# EAGLE design beacon (EAGLE 6.4)
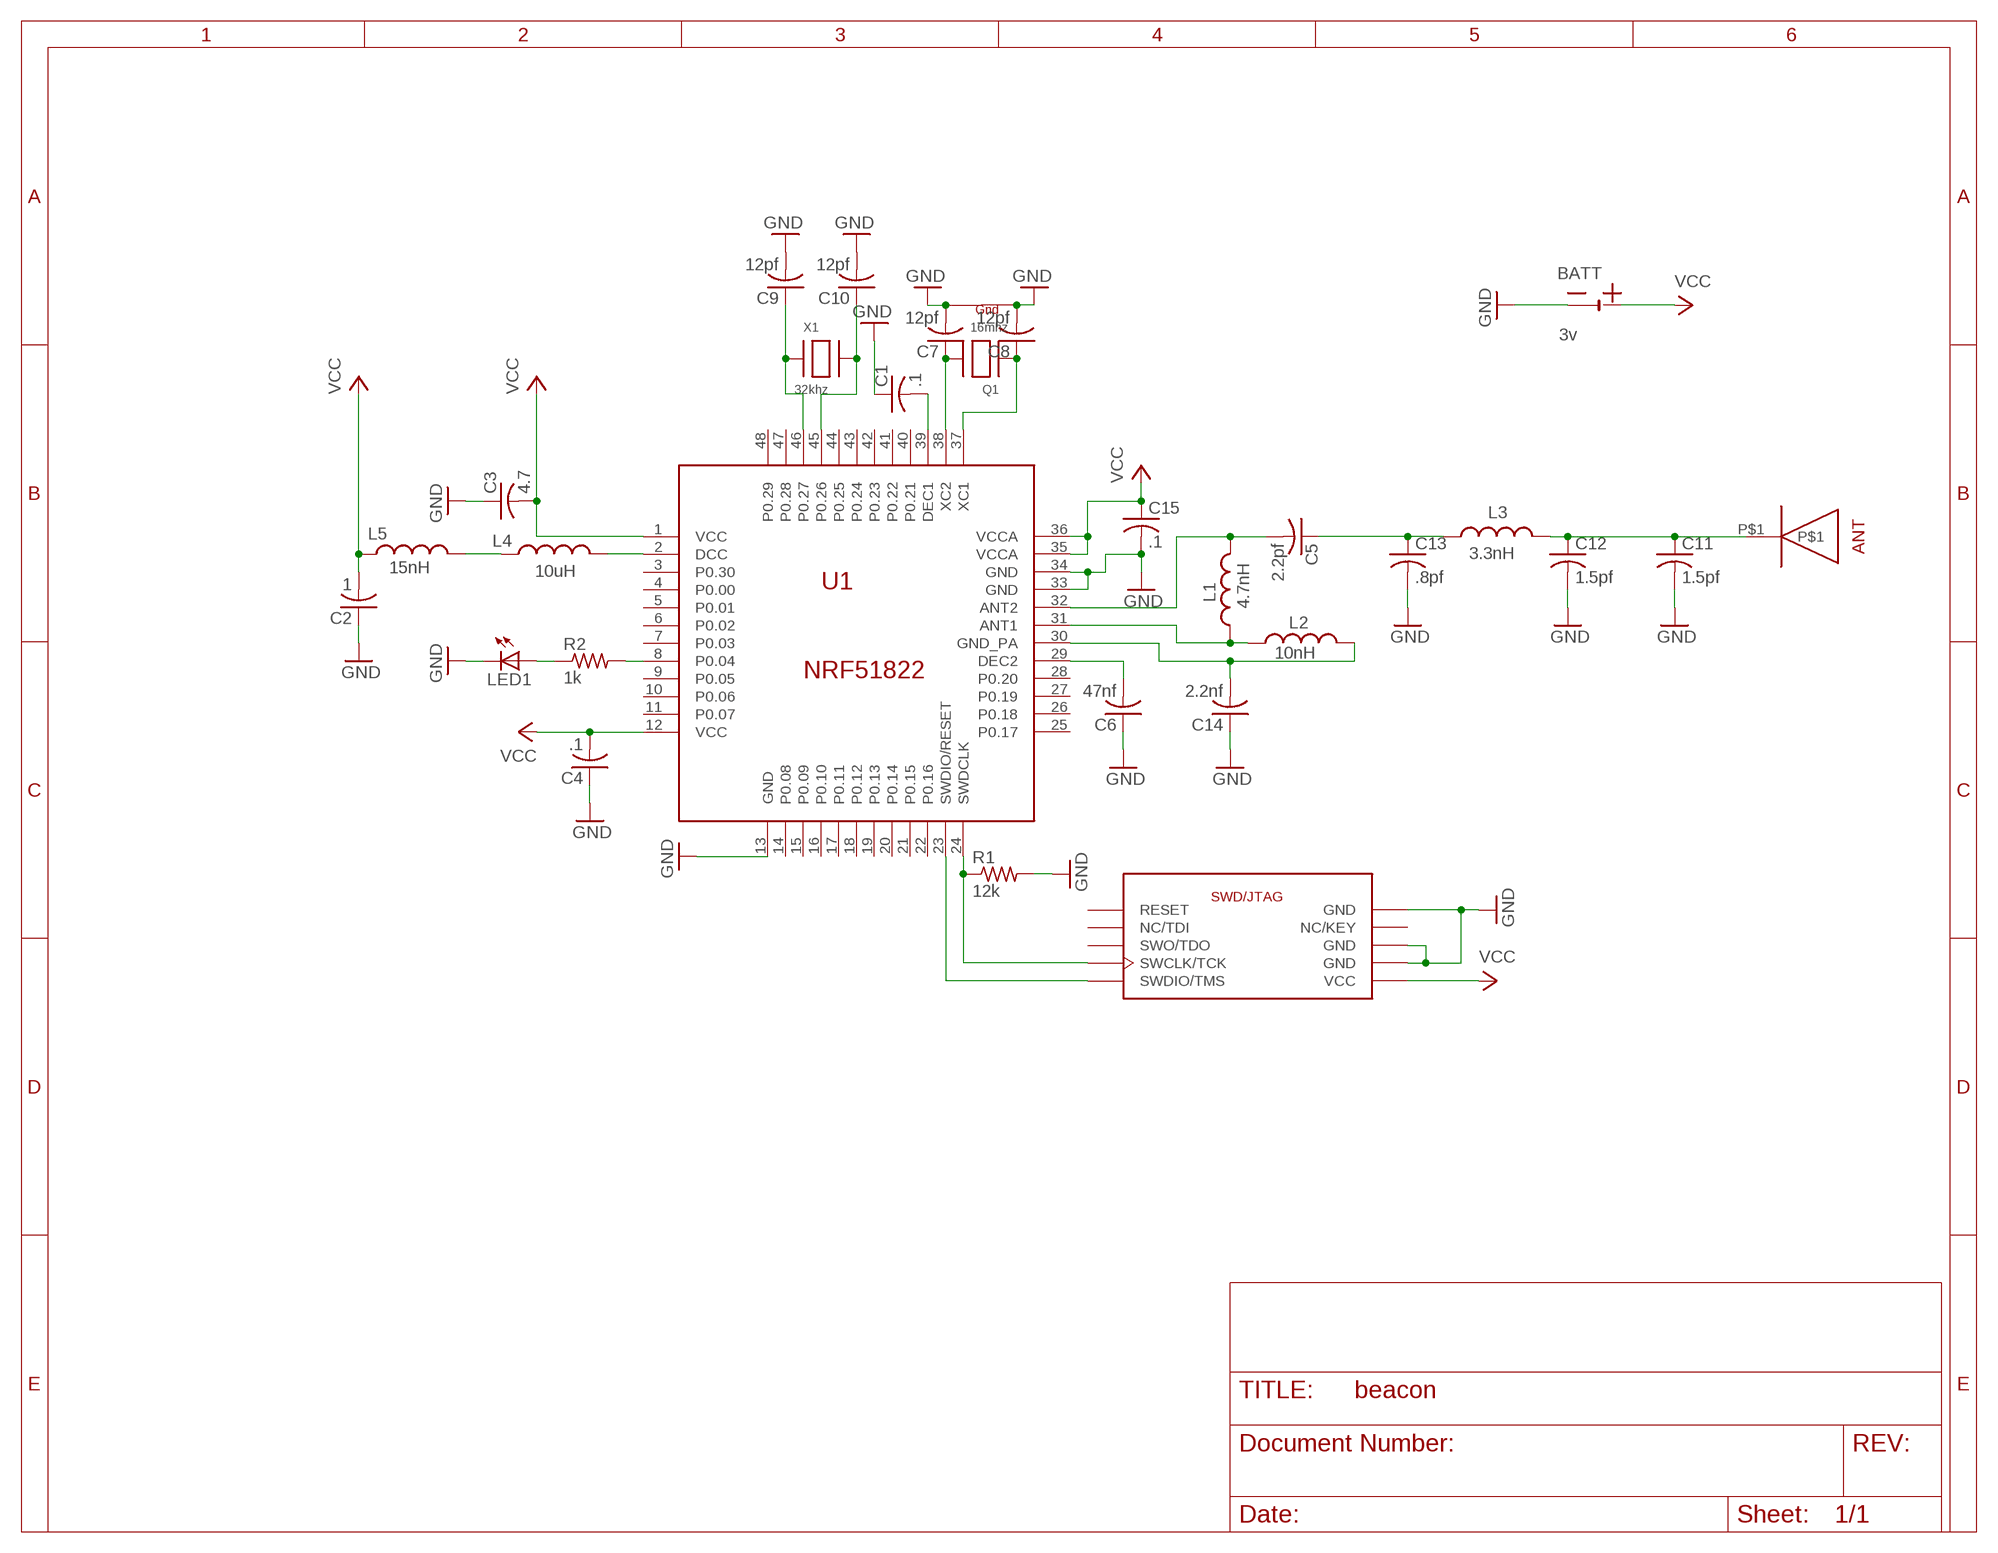
[diagram p0: schematic, sheet 1]

## Parts
BATT  3v  CR2032SMT  [CR2032-SMD]
C1  .1  C-USC0603  [C0603]
C2  1  C-USC0603  [C0603]
C3  4.7  C-USC0603  [C0603]
C4  .1  C-USC0603  [C0603]
C5  2.2pf  C-USC0603  [C0603]
C6  47nf  C-USC0603  [C0603]
C7  12pf  C-USC0603  [C0603]
C8  12pf  C-USC0603  [C0603]
C9  12pf  C-USC0603  [C0603]
C10  12pf  C-USC0603  [C0603]
C11  1.5pf  C-USC0603  [C0603]
C12  1.5pf  C-USC0603  [C0603]
C13  .8pf  C-USC0603  [C0603]
C14  2.2nf  C-USC0603  [C0603]
C15  .1  C-USC0603  [C0603]
L1  4.7nH  INDUCTOR0603  [0603]
L2  10nH  INDUCTOR0603  [0603]
L3  3.3nH  INDUCTOR0603  [0603]
L4  10uH  INDUCTOR0603  [0603]
L5  15nH  INDUCTOR0603  [0603]
LED1  LEDCHIP-LED0603  [CHIP-LED0603]
Q1  16mhz  XTAL-4-3225  [NX3225]
R1  12k  R-US_R0603  [R0603]
R2  1k  R-US_R0603  [R0603]
U1  NRF51822  [QFN40P600X600X100-49N]
U$1  SWD_HEADERSWD_SMT  [SWD_SMT]
U$2  BLE_ANT  [BLE_ANT]
X1  32khz  XTAL-3.2X1.5  [XTAL3215]

## Nets
GND: BATT.- C1.1 C2.1 C3.1 C4.1 C6.1 C7.2 C8.2 C9.2 C10.2 C11.2 C12.2 C13.2 C14.1 C15.2 LED1.C Q1.2(G2) Q1.4(G1) R1.2 U1.13(GND) U1.33(GND) U1.34(GND) U$1.P3(GND) U$1.P5(GND) U$1.P9(GND)
N$1: C1.2 U1.39(DEC1)
N$2: C6.2 U1.29(DEC2)
N$3: C7.1 Q1.3(X2) U1.38(XC2)
N$4: C8.1 Q1.1(X1) U1.37(XC1)
N$5: C9.1 U1.46(P0.27) X1.P$1
N$6: C10.1 U1.45(P0.26) X1.P$2
N$7: C11.1 C12.1 L3.2 U$2.P$1
N$8: LED1.A R2.1
N$9: R2.2 U1.8(P0.04)
N$10: L4.2 U1.2(DCC)
N$11: L4.1 L5.2
N$12: L1.1 L2.1 U1.31(ANT1)
N$13: C14.2 L2.2 U1.30(GND_PA)
N$14: C5.2 L1.2 U1.32(ANT2)
N$15: C5.1 C13.1 L3.1
SWDCLK: R1.1 U1.24(SWDCLK) U$1.P4(SWCLK/TCK)
SWDIO: U1.23(SWDIO/RESET) U$1.P2(SWDIO/TMS)
VCC: BATT.+$1(+1) BATT.+$2(+1) C2.2 C3.2 C4.2 C15.1 L5.1 U1.1(VCC) U1.12(VCC) U1.35(VCCA) U1.36(VCCA) U$1.P1(VCC)
Unconnected: U1.3(P0.30) U1.4(P0.00) U1.5(P0.01) U1.6(P0.02) U1.7(P0.03) U1.9(P0.05) U1.10(P0.06) U1.11(P0.07) U1.14(P0.08) U1.15(P0.09) U1.16(P0.10) U1.17(P0.11) U1.18(P0.12) U1.19(P0.13) U1.20(P0.14) U1.21(P0.15) U1.22(P0.16) U1.25(P0.17) U1.26(P0.18) U1.27(P0.19) U1.28(P0.20) U1.40(P0.21) U1.41(P0.22) U1.42(P0.23) U1.43(P0.24) U1.44(P0.25) U1.47(P0.28) U1.48(P0.29) U$1.P6(SWO/TDO) U$1.P7(NC/KEY) U$1.P8(NC/TDI) U$1.P10(RESET)

## Library data of the parts
BATT = smartmocha:CR2032
C1 C2 C4 C15 = adafruit:C-US: CAPACITOR, American symbol
C3 = adafruit:C-US: CAPACITOR, American symbol; MOUSER: 80-C0603C475K8P
C5 = adafruit:C-US: CAPACITOR, American symbol; DIGIKEY: 1276-1084-1-ND
C6 = adafruit:C-US: CAPACITOR, American symbol; MOUSER: 81-GRM188R71H473KA61
C7-C10 = adafruit:C-US: CAPACITOR, American symbol; MOUSER: 603-CC603JRNPO9BN120
C11 C12 = adafruit:C-US: CAPACITOR, American symbol; MOUSER: 77-VJ0603A1R5BXJPBC
C13 = adafruit:C-US: CAPACITOR, American symbol; MOUSER: 81-GJM1555C1HR80WB1D
C14 = adafruit:C-US: CAPACITOR, American symbol; DIGIKEY: 399-1085-1-ND
L1 = smartmocha:INDUCTOR: Inductors Basic Inductor/Choke - 0603 and 1206. Footprints are not proven and vary greatly between part numbers.; DIGIKEY: 587-1541-1-ND
L2 = smartmocha:INDUCTOR: Inductors Basic Inductor/Choke - 0603 and 1206. Footprints are not proven and vary greatly between part numbers.; MOUSER: 871-B82496C3100J
L3 = smartmocha:INDUCTOR: Inductors Basic Inductor/Choke - 0603 and 1206. Footprints are not proven and vary greatly between part numbers.; MOUSER: 609-L-14C3N3SV4T
L4 = smartmocha:INDUCTOR: Inductors Basic Inductor/Choke - 0603 and 1206. Footprints are not proven and vary greatly between part numbers.; MOUSER: 963-LK1608100K-T
L5 = smartmocha:INDUCTOR: Inductors Basic Inductor/Choke - 0603 and 1206. Footprints are not proven and vary greatly between part numbers.; MOUSER: 871-B82496C3150J
LED1 = adafruit:LED: LED OSRAM: - CHIPLED LG R971, LG N971, LY N971, LG Q971, LY Q971, LO R971, LY R971 LH N974, LH R974 LS Q976, LO Q976, LY Q976 LO Q996 - Hyper CHIPLED LW Q18S LB Q993, LB Q99A, LB R99A - SideLED LS A670, LO A670, LY A670, LG A670, LP A670 LB A673, LV A673, LT A673, LW A673 LH A674 LY A675 LS A676, LA A676, LO A676, LY A676, LW A676 LS A679, LY A679, LG A679 - Hyper Micro SIDELED® LS Y876, LA Y876, LO Y876, LY Y876 LT Y87S - SmartLED LW L88C, LW L88S LB L89C, LB L89S, LG L890 LS L89K, LO L89K, LY L89K LS L896, LA L896, LO L896, LY L896 - TOPLED LS T670, LO T670, LY T670, LG T670, LP T670 LSG T670, LSP T670, LSY T670, LOP T670, LYG T670 LG T671, LOG T671, LSG T671 LB T673, LV T673, LT T673, LW T673 LH T674 LS T676, LA T676, LO T676, LY T676, LB T676, LH T676, LSB T676, LW T676 LB T67C, LV T67C, LT T67C, LS T67K, LO T67K, LY T67K, LW E67C LS E67B, LA E67B, LO E67B, LY E67B, LB E67C, LV E67C, LT E67C LW T67C LS T679, LY T679, LG T679 LS T770, LO T770, LY T770, LG T770, LP T770 LB T773, LV T773, LT T773, LW T773 LH T774 LS E675, LA E675, LY E675, LS T675 LS T776, LA T776, LO T776, LY T776, LB T776 LHGB T686 LT T68C, LB T68C - Hyper Mini TOPLED® LB M676 - Mini TOPLED Santana® LG M470 LS M47K, LO M47K, LY M47K Source: http://www.osram.convergy.de/
Q1 = adafruit:XTAL-4: Classic 4-pin 3.2 x 2.5mm crystal; DIGIKEY: 535-10267-1-ND; MOUSER: 815-ABM8G-16-18D2Y
R1 = adafruit:R-US_: RESISTOR, American symbol; DIGIKEY: RMCF0603JT12K0CT-ND; MOUSER: 667-ERJ-U03F1202V
R2 = adafruit:R-US_: RESISTOR, American symbol
U1 = smartmocha:NRF51822
U$1 = smartmocha:SWD_HEADER
U$2 = smartmocha:BLE_ANT
X1 = adafruit:XTAL: Low cost SMT crystals, no capacitors included http://www.ladyada.net/library/eagle; MOUSER: 815-ABS07-32.768KHZT

## Board
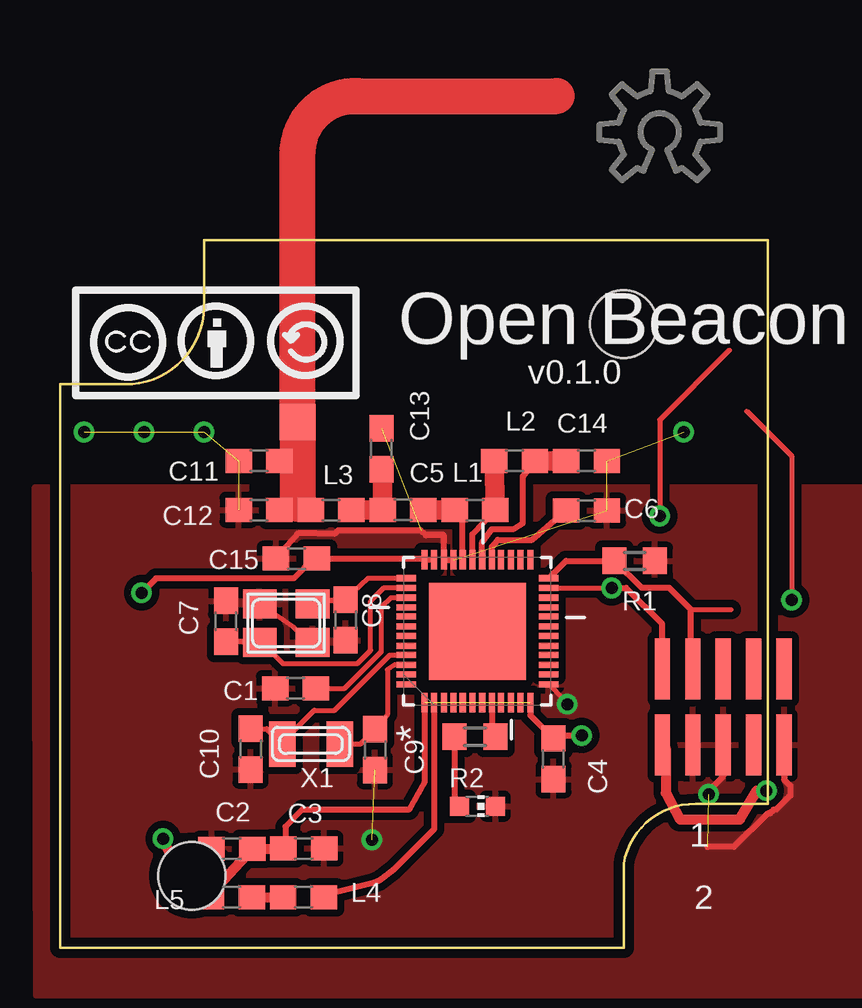
[diagram p1: board, top side]
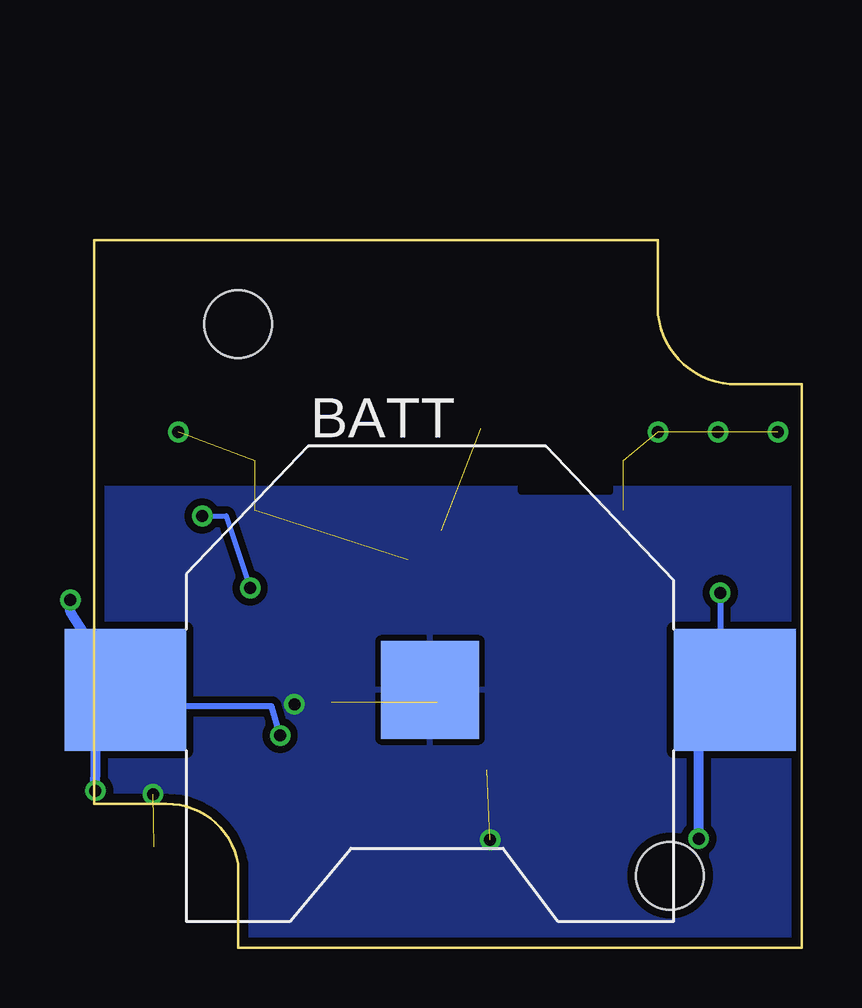
[diagram p2: board, bottom side, seen from below]

Size 29.5 x 29.5 mm. Coordinates in mm from the lower left corner, seen from the top.
Outline: 0,0 23.5,0 23.5,3.5 arc-81 26.5,6 29.5,6 29.5,29.5 6,29.5 6,27 arc-90 3,23.5 0,23.5 0,0
Copper layers (1*16): Top 0.0356mm / dielectric 1.5011mm / Bottom 0.0356mm
Design rules "LaenPCBOrder *": minimum track width 6mil, minimum drill 13mil, track to track 6mil, track to pad 6mil, pad to pad 6mil, via to via 6mil, smd to smd 6mil, copper to edge 15mil, drill to drill 6mil, minimum pad ring 7mil, minimum via ring 7mil, stop-mask expansion 4mil, vias tented up to drill 25mil, thermal gap 10mil
Holes 2.8 mm at 23.5,26 5.5,3

### Footprints (pad centres in the part's own frame; a part is rotated, then mirrored left to right if it is on the bottom)
CR2032-SMD = smd 5.08 x 5.08: +$1 -12.7,0; +$2 12.7,0 | smd 4.064 x 4.064: - 0,0
C0603 = smd 1.1 x 1: 1 -0.85,0; 2 0.85,0
0603 = smd 1.1 x 1: 1 -0.85,0; 2 0.85,0
CHIP-LED0603 = smd 0.8 x 0.8: A 0,-0.75; C 0,0.75
NX3225 = smd 1.4 x 1.2: 1 -1.1,-0.8; 2 1.1,-0.8; 3 1.1,0.8; 4 -1.1,0.8
R0603 = smd 1 x 1.1: 1 -0.85,0; 2 0.85,0
QFN40P600X600X100-49N = smd 0.813 x 0.254: 1 -2.972,2.21; 2 -2.972,1.803; 3 -2.972,1.397; 4 -2.972,0.991; 5 -2.972,0.61; 6 -2.972,0.203; 7 -2.972,-0.203; 8 -2.972,-0.61; 9 -2.972,-0.991; 10 -2.972,-1.397; 11 -2.972,-1.803; 12 -2.972,-2.21; 25 2.972,-2.21; 26 2.972,-1.803; 27 2.972,-1.397; 28 2.972,-0.991; 29 2.972,-0.61; 30 2.972,-0.203; 31 2.972,0.203; 32 2.972,0.61; 33 2.972,0.991; 34 2.972,1.397; 35 2.972,1.803; 36 2.972,2.21 | smd 0.254 x 0.813: 13 -2.21,-2.972; 14 -1.803,-2.972; 15 -1.397,-2.972; 16 -0.991,-2.972; 17 -0.61,-2.972; 18 -0.203,-2.972; 19 0.203,-2.972; 20 0.61,-2.972; 21 0.991,-2.972; 22 1.397,-2.972; 23 1.803,-2.972; 24 2.21,-2.972; 37 2.21,2.972; 38 1.803,2.972; 39 1.397,2.972; 40 0.991,2.972; 41 0.61,2.972; 42 0.203,2.972; 43 -0.203,2.972; 44 -0.61,2.972; 45 -0.991,2.972; 46 -1.397,2.972; 47 -1.803,2.972; 48 -2.21,2.972 | smd 4.039 x 4.039: 49 0,0
SWD_SMT = smd 2.54 x 0.635: P1 0,5.08; P2 3.175,5.08; P3 0,3.81; P4 3.175,3.81; P5 0,2.54; P6 3.175,2.54; P7 0,1.27; P8 3.175,1.27; P9 0,0; P10 3.175,0
BLE_ANT = smd 1.5 x 1.5: P$1 0,-8
XTAL3215 = smd 1.1 x 1.9: P$1 1.2,0; P$2 -1.2,0

### Placement (x,y rotation side)
BATT  15.5,10.75 180 bottom
C1  9.82,10.81 0 top
C2  7.17,4.12 0 top
C3  10.17,4.14 180 top
C4  20.57,7.88 90 top
C5  14.3,18.25 0 top
C6  21.95,18.23 180 top
C7  6.93,13.62 90 top
C8  11.91,13.66 270 top
C9  13.13,8.26 270 top
C10  7.94,8.28 270 top
C11  8.3,20.3 180 top
C12  8.3,18.25 180 top
C13  13.4,20.8 90 top
C14  21.95,20.3 180 top
C15  9.86,16.23 180 top
L1  17.3,18.25 180 top
L2  18.95,20.3 0 top
L3  11.3,18.25 180 top
L4  10.15,2.1 0 top
L5  7.15,2.1 0 top
LED1  17.4,5.9 270 top
Q1  9.43,13.54 180 top
R1  23.96,16.13 0 top
R2  17.3,8.8 0 top
U1  17.4,13.2 90 top
U$1  30.19,8.46 90 top
U$2  9.91,29.91 0 top
U$3  [LOGO_CC-BY-SA]  1,23.35 0 top
U$4  [OSHWLOGO_TOL_0.2]  25,34 0 top  (outside the outline)
X1  10.46,8.49 0 top

### Tracks (layer width: path | path; a pad name or v marks a point on that pad's centre or on a via)
GND  (via drill 0.5)  (10 unrouted)
  Top 0.2: Q1.4 10.37,12.73 9.75,13.35 Q1.2 | U1.13 20.39,11 v21.15,10.15
  Top 0.254: U1.33 U1.34 16,17.2 15.25,17.2 15.05,17.4 11.6,17.4 11.45,17.25 9.95,17.28 C15.2 | U$1.P5 27.65,7.15 27,6.5 | U$1.P9 30.19,7.01 30.45,6.75 30.45,6.35 29.85,5.75 29.75,5.75 29.6,5.6 29.5,5.6 28.1,4.2 27.01,4.2
  other vias: 1,21.5 3.5,21.5 6,21.5 26,21.5 13,4.5 27.05,6.4
  pour Bottom (isolate 0.305): -0.42,19.15 0.08,-2.3 45.72,-2.3 45.22,19.15
  pour Top (isolate 0.305): -1.05,19.2 45.95,19.2 46,-2 -1,-2
N$1
  Top 0.2: C1.2 11.87,10.81 13.4,12.35 13.4,14.2 13.79,14.59 U1.39
N$2
  Top 0.254: U1.29 18.01,16.71 18.25,17 19.68,17 C6.2
N$3
  Top 0.2: Q1.3 8.41,12.73 9.3,11.85 12.4,11.85 12.95,12.4 12.95,14.45 13.5,15 U1.38
  Top 0.254: C7.1 6.86,12.81 Q1.3
N$4
  Top 0.2: U1.37 12.85,15.4 C8.1
  Top 0.254: Q1.1 10.28,14.44 C8.1
N$5
  Top 0.2: X1.P$1 12.52,8.49 C9.1 13.65,9.72 13.65,11.6 13.95,11.8 U1.46
N$6
  Top 0.2: C10.1 8.62,9.13 X1.P$2 9.26,8.56 10.6,9.9 11.45,9.9 13.75,12.2 U1.45
N$7
  Top 0.254: C11.1 9.71,20.2 arc-90 9.91,20 | L3.2 10.2,18.2 arc-90 9.9,18.5 arc-90 9.6,18.2 C12.1
  Top 1.5: U$2.P$1 9.91,20 9.91,18.51 arc-90 9.9,18.5
N$8
  Top 0.254: R2.1 16.45,6.1 LED1.A
N$9
  Top 0.254: U1.8 18.01,8.94 R2.2
N$10
  Top 0.254: U1.2 15.6,4.95 13.9,3.25 13.3,2.8 13.1,2.7 11.1,2.2 L4.2
N$11
  Top 0.406: L5.2 L4.1
N$12
  Top 0.254: U1.31 17.2,17.25 L1.1
  Top 0.813: L2.1 L1.1
N$13
  Top 0.254: U1.30 17.6,16.9 18,17.45 18.9,17.45 19.3,17.7 19.3,19.65 L2.2
  Top 0.813: L2.2 C14.2
N$14
  Top 0.254: U1.32 16.79,17.76 arc90 L1.2
  Top 0.813: L1.2 C5.2
N$15
  Top 0.813: C13.1 arc-90 13.45,19.8 C5.1 L3.1
N$18
  cutout Bottom: 8,25 8,19 11.7,19 11.7,25
N$19
  cutout Top: 8,25 8,19 11.7,19 11.7,25
SWDCLK
  Top 0.2: 26.3,14.1 27.98,14.1
  Top 0.254: U1.24 21.1,16.13 R1.1 24.25,15 25.4,15 26.3,14.1 26.3,11.71 U$1.P4
SWDIO  (via drill 0.5)
  Top 0.2: U1.23 v23,15 23.25,15 | 27.91,24.91 25,22 v25,18
  Top 0.254: 23.25,15 23.6,15 25.11,13.49 U$1.P2
  Bottom 0.2: v25,18 24,18 v23,15
VCC  (via drill 0.5)  (1 unrouted)
  Top 0.2: 28.63,22.37 30.5,20.5 v30.5,14.5
  Top 0.254: U1.12 19.61,9.7 C4.2 20.7,8.85 v21.75,8.85 | U1.1 15.19,6.89 14.55,5.75 10.1,5.75 9.4,5.05 9.4,4.23 C3.2 | U1.35 U1.36 15.13,16.23 C15.1 10.58,16.23 9.75,15.4 4,15.4 v3.4,14.8
  Top 0.406: C3.2 9.3,4.12 C2.2 6.35,2.31 L5.1 4.95,3.15 4.35,4.4 4.35,4.5 v4.3,4.55 | U$1.P1 25.25,8.31 25.25,6.45 25.85,5.35 28.35,5.35 29.05,6.55 v29.45,6.55
  Bottom 0.254: v21.75,8.85 22.11,10.06 28.39,10.06 | v3.4,14.8 3.4,12 | 3.4,12 3.4,10.28 3.58,10.1 | BATT.+$1 2.8,11.4 3.4,12 | BATT.+$2 28.27,10.81 28.39,10.81 28.39,11.22 29.3,12.13
  Bottom 0.406: v29.45,6.55 29.39,9.99 28.39,10.06 28.39,10.81 | v4.3,4.55 4.3,9.5 3.58,10.1 | 28.7,11.2 29.3,12.13 30.5,14 v30.5,14.5

### Text on the board
tPlace: Open Beacon | v0.1.0 | 1 | 2